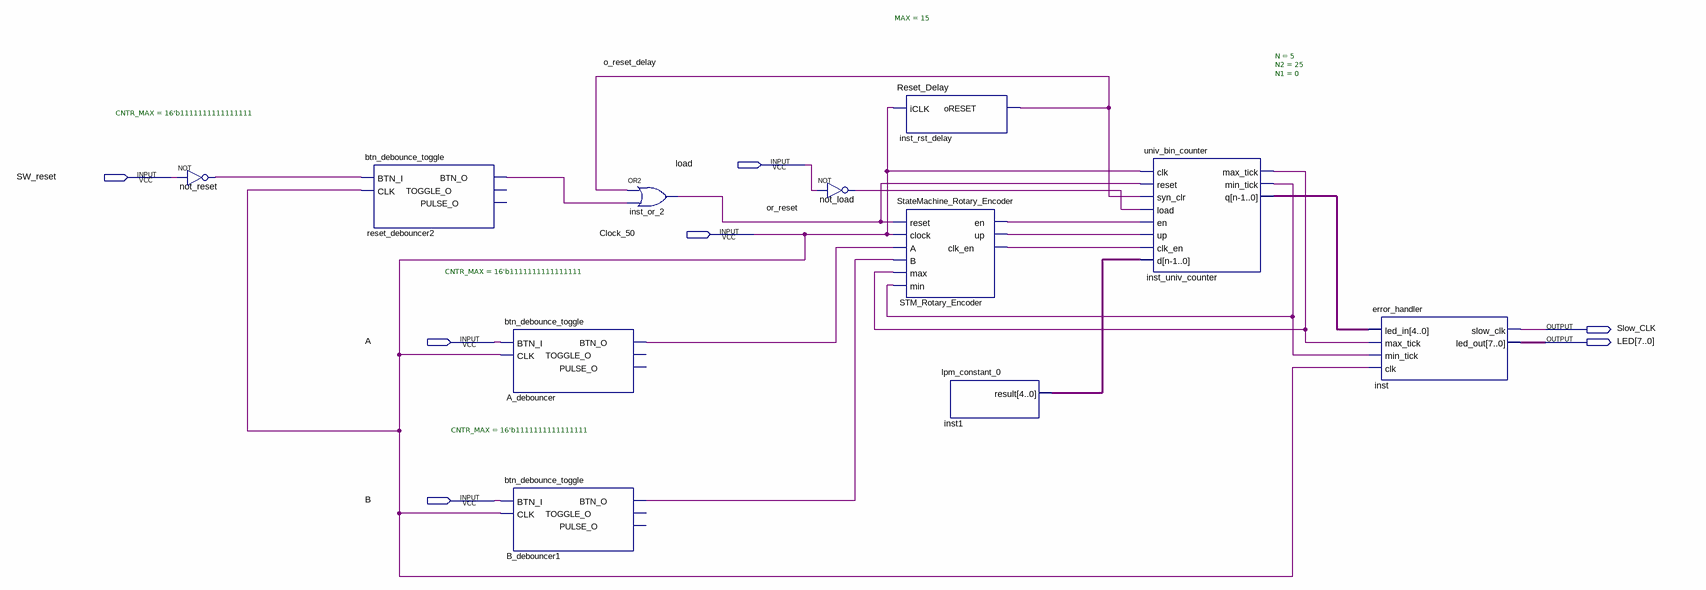
[diagram p0: schematic sheet]
// Quartus schematic Digital_Encoder_Lab3.bdf as structural Verilog: 11 symbols, 7 pins
module Digital_Encoder_Lab3 (
  input  load,
  input  SW_reset,
  input  Clock_50,
  input  A,
  input  B,
  output Slow_CLK,
  output [7:0] LED
);

  wire A_debouncer_btn_o, B_debouncer1_btn_o, inst_univ_counter_max_tick, inst_univ_counter_min_tick,
       not_load_out, not_reset_out, o_reset_delay, or_reset, reset_debouncer2_btn_o,
       STM_Rotary_Encoder_clk_en, STM_Rotary_Encoder_en, STM_Rotary_Encoder_up;
  wire [4:0] inst1_result, inst_univ_counter_q;

  not not_reset (not_reset_out, SW_reset);
  btn_debounce_toggle #(.CNTR_MAX(16'b1111111111111111)) reset_debouncer2 (
    .BTN_I(not_reset_out), .CLK(Clock_50), .BTN_O(reset_debouncer2_btn_o));  // open: TOGGLE_O, PULSE_O
  btn_debounce_toggle #(.CNTR_MAX(16'b1111111111111111)) A_debouncer (
    .BTN_I(A), .CLK(Clock_50), .BTN_O(A_debouncer_btn_o));  // open: TOGGLE_O, PULSE_O
  btn_debounce_toggle #(.CNTR_MAX(16'b1111111111111111)) B_debouncer1 (
    .BTN_I(B), .CLK(Clock_50), .BTN_O(B_debouncer1_btn_o));  // open: TOGGLE_O, PULSE_O
  or inst_or_2 (or_reset, o_reset_delay, reset_debouncer2_btn_o);
  not not_load (not_load_out, load);
  Reset_Delay #(.MAX(15)) inst_rst_delay (.iCLK(Clock_50), .oRESET(o_reset_delay));
  StateMachine_Rotary_Encoder STM_Rotary_Encoder (
    .reset(or_reset), .clock(Clock_50), .A(A_debouncer_btn_o), .B(B_debouncer1_btn_o),
    .max(inst_univ_counter_max_tick), .min(inst_univ_counter_min_tick), .en(STM_Rotary_Encoder_en),
    .up(STM_Rotary_Encoder_up), .clk_en(STM_Rotary_Encoder_clk_en));
  lpm_constant_0 inst1 (.result(inst1_result));
  univ_bin_counter #(.N(5), .N2(25), .N1(0)) inst_univ_counter (
    .clk(Clock_50), .reset(or_reset), .syn_clr(o_reset_delay), .load(not_load_out),
    .en(STM_Rotary_Encoder_en), .up(STM_Rotary_Encoder_up), .clk_en(STM_Rotary_Encoder_clk_en),
    .d(inst1_result), .max_tick(inst_univ_counter_max_tick), .min_tick(inst_univ_counter_min_tick),
    .q(inst_univ_counter_q));
  error_handler inst (
    .led_in(inst_univ_counter_q), .max_tick(inst_univ_counter_max_tick),
    .min_tick(inst_univ_counter_min_tick), .clk(Clock_50), .slow_clk(Slow_CLK), .led_out(LED));
endmodule
